# EAGLE design threshold_control_device_smd (EAGLE 6.2)
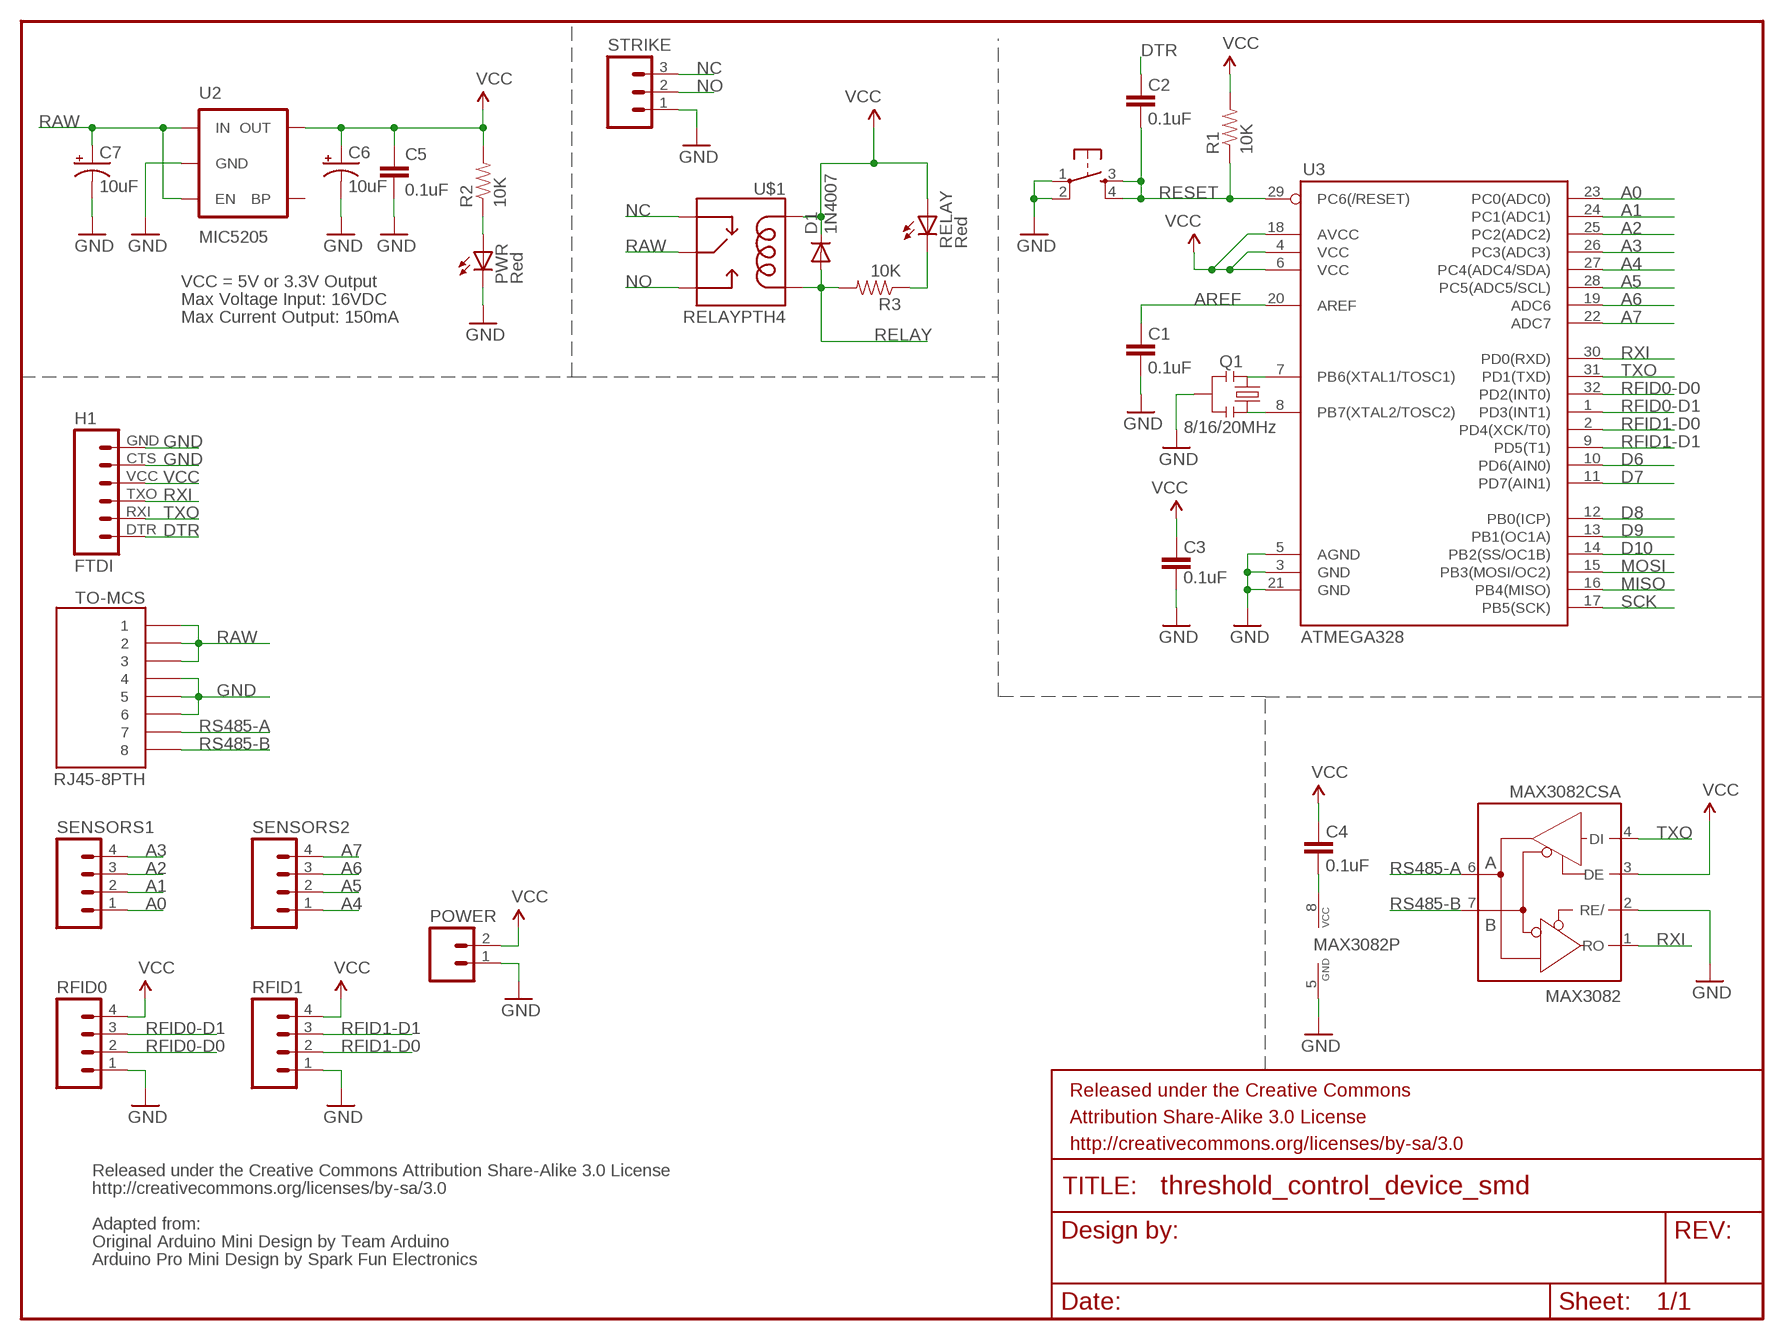
[diagram p0: schematic, sheet 1]

## Parts
C1  0.1uF  CAP0402-CAP  [0402-CAP]
C2  0.1uF  CAP0402-CAP  [0402-CAP]
C3  0.1uF  CAP0402-CAP  [0402-CAP]
C4  0.1uF  CAP0402-CAP  [0402-CAP]
C5  0.1uF  CAP0402-CAP  [0402-CAP]
C6  10uF  CAP_POL1206  [EIA3216]
C7  10uF  CAP_POL1206  [EIA3216]
D1  1N4007  DIODESMA  [SMA-DIODE]
FRAME1  FRAME-LETTER  [CREATIVE_COMMONS]
H1  FTDI  FTDI_BASICPTH  [FTDI_BASIC]
MAX3082  MAX3082CSA  MAX481CSA  [SO08]
POWER  M023.5MM  [SCREWTERMINAL-3.5MM-2]
PWR  Red  LED0603  [LED-0603]
Q1  8/16/20MHz  RESONATORSMD  [RESONATOR-SMD]
R1  10K  RESISTOR0402-RES  [0402-RES]
R2  10K  RESISTOR0402-RES  [0402-RES]
R3  10K  RESISTOR0402-RES  [0402-RES]
RELAY  Red  LED0603  [LED-0603]
RESET  Reset  TAC_SWITCHSMD  [TACTILE_SWITCH_SMD]
RFID0  M04SCREW  [SCREWTERMINAL-3.5MM-4]
RFID1  M04SCREW  [SCREWTERMINAL-3.5MM-4]
SENSORS1  M04SCREW  [SCREWTERMINAL-3.5MM-4]
SENSORS2  M04SCREW  [SCREWTERMINAL-3.5MM-4]
STRIKE  M03SCREW  [SCREWTERMINAL-3.5MM-3]
TO-MCS  RJ45-8PTH  [RJ45-8]
U2  MIC5205  V_REG_LDOSMD  [SOT23-5]
U3  ATMEGA328  ATMEGA168  [TQFP32-08]
U$1  RELAYPTH4  [RELAY-JZC]

## Nets
A0: SENSORS1.1 U3.23(PC0(ADC0))
A1: SENSORS1.2 U3.24(PC1(ADC1))
A2: SENSORS1.3 U3.25(PC2(ADC2))
A3: SENSORS1.4 U3.26(PC3(ADC3))
A4: SENSORS2.1 U3.27(PC4(ADC4/SDA))
A5: SENSORS2.2 U3.28(PC5(ADC5/SCL))
A6: SENSORS2.3 U3.19(ADC6)
A7: SENSORS2.4 U3.22(ADC7)
AREF: C1.2 U3.20(AREF)
D6: U3.10(PD6(AIN0))
D7: U3.11(PD7(AIN1))
D8: U3.12(PB0(ICP))
D9: U3.13(PB1(OC1A))
D10: U3.14(PB2(SS/OC1B))
DTR: C2.2 H1.DTR
GND [vcc]: C1.1 C3.1 C5.2 C6.C(-) C7.C(-) H1.CTS H1.GND MAX3082.2(RE/) MAX3082.5(GND) POWER.1 PWR.C Q1.2 RESET.1 RESET.2 RFID0.1 RFID1.1 STRIKE.1 TO-MCS.4 TO-MCS.5 TO-MCS.6 U2.2(GND) U3.3(GND) U3.5(AGND) U3.21(GND)
MISO: U3.16(PB4(MISO))
MOSI: U3.15(PB3(MOSI/OC2))
N$1: Q1.1 U3.8(PB7(XTAL2/TOSC2))
N$2: Q1.3 U3.7(PB6(XTAL1/TOSC1))
N$3: C4.1 MAX3082.8(VCC)
N$4: R3.1 RELAY.C
N$38: PWR.A R2.1
NC: STRIKE.3 U$1.2(NC)
NO: STRIKE.2 U$1.3(NO)
RAW [vcc]: C7.A(+) TO-MCS.1 TO-MCS.2 TO-MCS.3 U2.1(IN) U2.3(EN) U$1.4(MAIN)
RELAY: D1.A R3.2 U$1.1(COIL2)
RESET: C2.1 R1.1 RESET.3 RESET.4 U3.29(PC6(/RESET))
RFID0-D0: RFID0.2 U3.32(PD2(INT0))
RFID0-D1: RFID0.3 U3.1(PD3(INT1))
RFID1-D0: RFID1.2 U3.2(PD4(XCK/T0))
RFID1-D1: RFID1.3 U3.9(PD5(T1))
RS485-A: MAX3082.6(A) TO-MCS.7
RS485-B: MAX3082.7(B) TO-MCS.8
RXI: H1.TXO MAX3082.1(RO) U3.30(PD0(RXD))
SCK: U3.17(PB5(SCK))
TXO: H1.RXI MAX3082.4(DI) U3.31(PD1(TXD))
VCC: C3.2 C4.2 C5.1 C6.A(+) D1.C H1.VCC MAX3082.3(DE) POWER.2 R1.2 R2.2 RELAY.A RFID0.4 RFID1.4 U2.5(OUT) U3.4(VCC) U3.6(VCC) U3.18(AVCC) U$1.5(COIL1)
Unconnected: U2.4(BP)

## Notes on the sheet
- VCC = 5V or 3.3V Output
- Max Voltage Input: 16VDC
- Max Current Output: 150mA
- Released under the Creative Commons Attribution Share-Alike 3.0 License
- http://creativecommons.org/licenses/by-sa/3.0
- Adapted from:
- Original Arduino Mini Design by Team Arduino
- Arduino Pro Mini Design by Spark Fun Electronics

## Library data of the parts
C1-C5 = SparkFun:CAP: Capacitor Standard 0603 ceramic capacitor, and 0.1" leaded capacitor.
C6 C7 = SparkFun:CAP_POL: Capacitor Polarized These are standard SMD and PTH capacitors. Normally 10uF, 47uF, and 100uF in electrolytic and tantalum varieties. Always verify the external diameter of the through hole cap, it varies with capacity, voltage, and manufacturer. The EIA devices should be standard.
D1 = SparkFun-DiscreteSemi:DIODE: Diode These are standard reverse protection diodes and small signal diodes. SMA package can handle up to about 1A. SOD-323 can handle about 200mA. What the SOD-323 package when ordering, there are some mfgs out there that are 5-pin packages.
FRAME1 = SparkFun-Aesthetics:FRAME-LETTER: Schematic Frame Standard 8.5x11 US Letter frame
H1 = SparkFun-Connectors:FTDI_BASIC: FTDI Basic header with labels
MAX3082 = maxim:MAX481CSA: RS485 TRANSEIVER; MF: MAXIM; MPN: MAX481CSA; OC_FARNELL: unknown; OC_NEWARK: 90C3817
POWER = SparkFun-Connectors:M02: Header 2 Standard 2-pin 0.1" header. Use with straight break away headers (SKU : PRT-00116), right angle break away headers (PRT-00553), swiss pins (PRT-00743), machine pins (PRT-00117), and female headers (PRT-00115). Molex polarized connector foot print use with SKU : PRT-08233 with associated crimp pins and housings.
PWR RELAY = SparkFun:LED: LEDs Standard schematic elements and footprints for 5mm, 3mm, 1206, and 0603 sized LEDs. 5mm - Spark Fun Electronics SKU : COM-00529 (and others)
Q1 = SparkFun:RESONATOR: Resonator Small SMD resonator. This is the itty bitty 10/20MHz resonators with built in caps. CSTCE10M0G55 and CSTCE20M0V53. Footprint has been reviewed closely but hasn't been tested yet.
R1-R3 = SparkFun:RESISTOR: Resistor Basic schematic elements and footprints for 0603, 1206, and PTH resistors.
RESET = SparkFun:TAC_SWITCH: Momentary Switch Button commonly used for reset or general input. Spark Fun Electronics SKU : COM-00097
RFID0 RFID1 SENSORS1 SENSORS2 = SparkFun-Connectors:M04: Header 4 Standard 4-pin 0.1" header. Use with straight break away headers (SKU : PRT-00116), right angle break away headers (PRT-00553), swiss pins (PRT-00743), machine pins (PRT-00117), and female headers (PRT-00115). Molex polarized connector foot print use with SKU : PRT-08231 with associated crimp pins and housings. 1MM SMD Version SKU: PRT-10208
STRIKE = SparkFun-Connectors:M03: Header 3 Standard 3-pin 0.1" header. Use with straight break away headers (SKU : PRT-00116), right angle break away headers (PRT-00553), swiss pins (PRT-00743), machine pins (PRT-00117), and female headers (PRT-00115). Molex polarized connector foot print use with SKU : PRT-08232 with associated crimp pins and housings.
TO-MCS = SparkFun:RJ45-8: RJ45 Jack Simple RJ45, 8-pin connection - connector for common Cat5, Cat5e, and Cat6 Ethernet cables. Footprint not yet proven in production. Connector sku is PRT-00643; Breakout PCB sku is BOB-00716.
U2 = SparkFun:V_REG_LDO: Voltage Regulator LDO Standard 150mA LDO voltage regulator in SOT-23 layout. Micrel part MIC5205. BP (by-pass) pin is used to lower output noise with 470pF cap.
U3 = SparkFun:ATMEGA168
U$1 = SparkFun-Electromechanical:RELAY: SPDT relay (COM-00101)

## Net classes
0 default: width 0.203 mm
1 vcc: width 0.254 mm

## Board
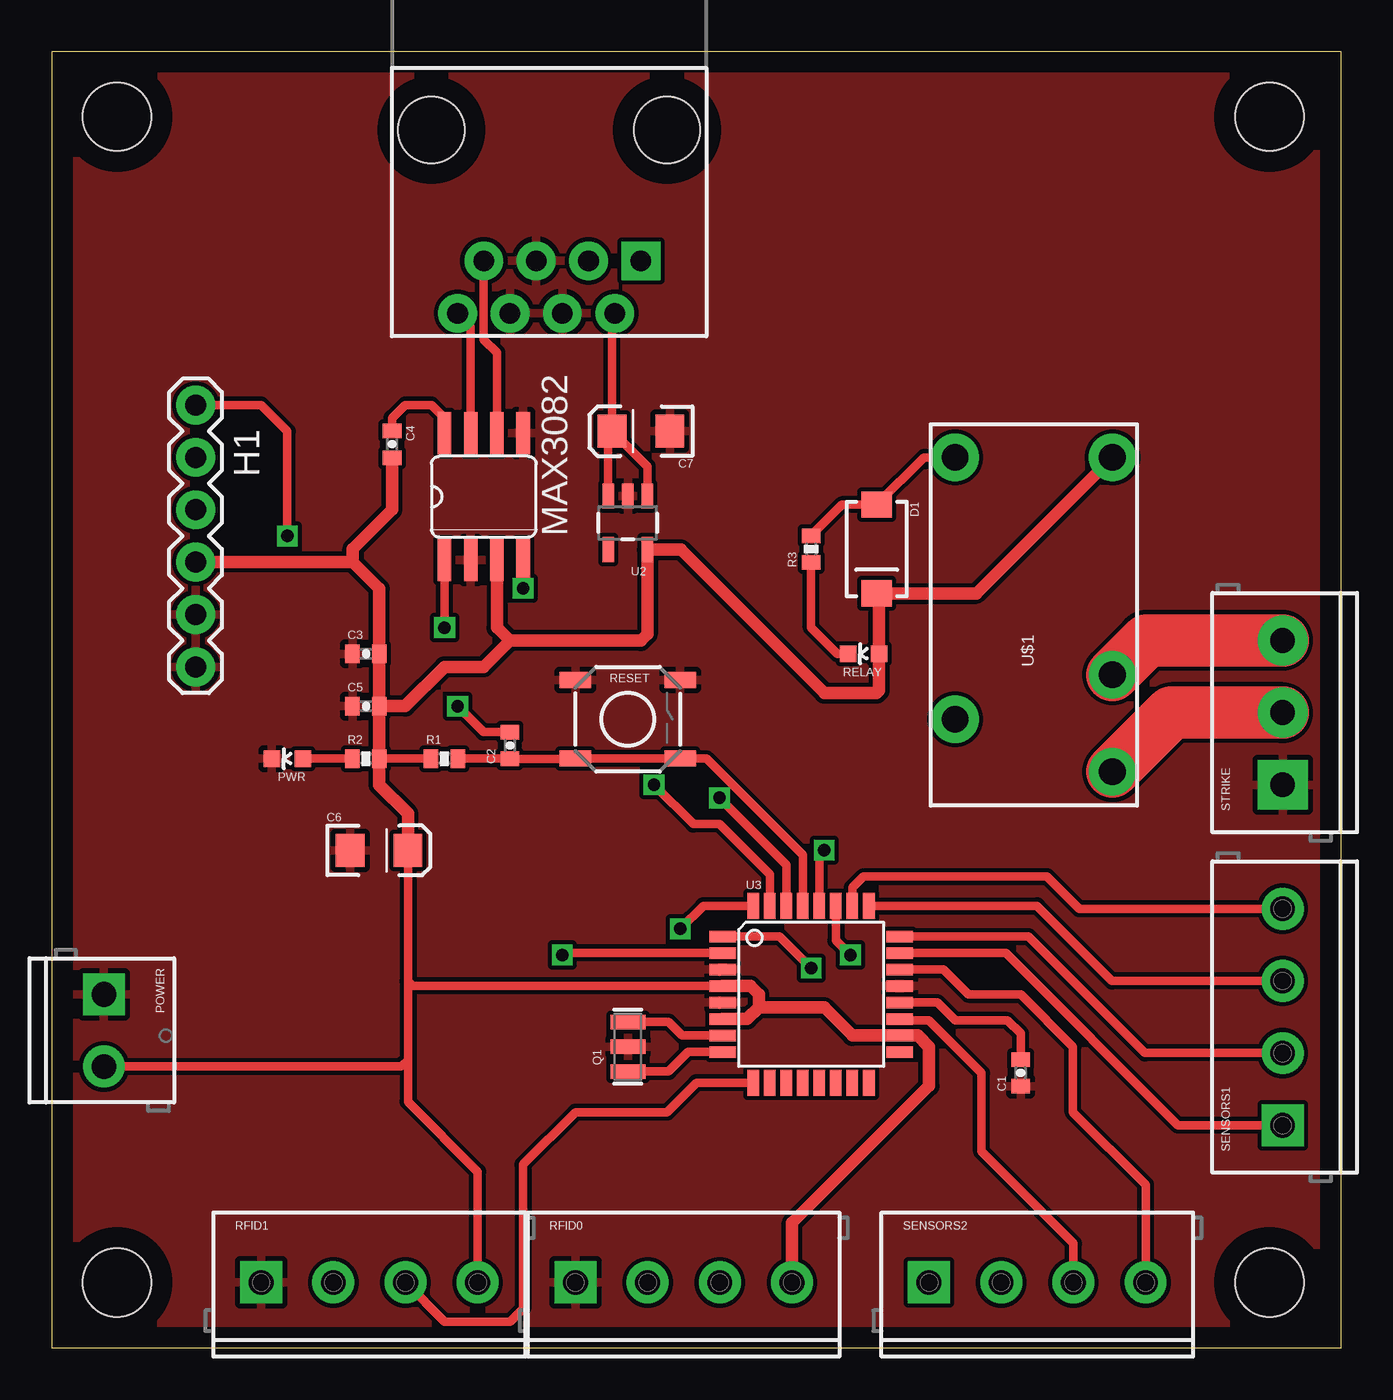
[diagram p1: board, top side]
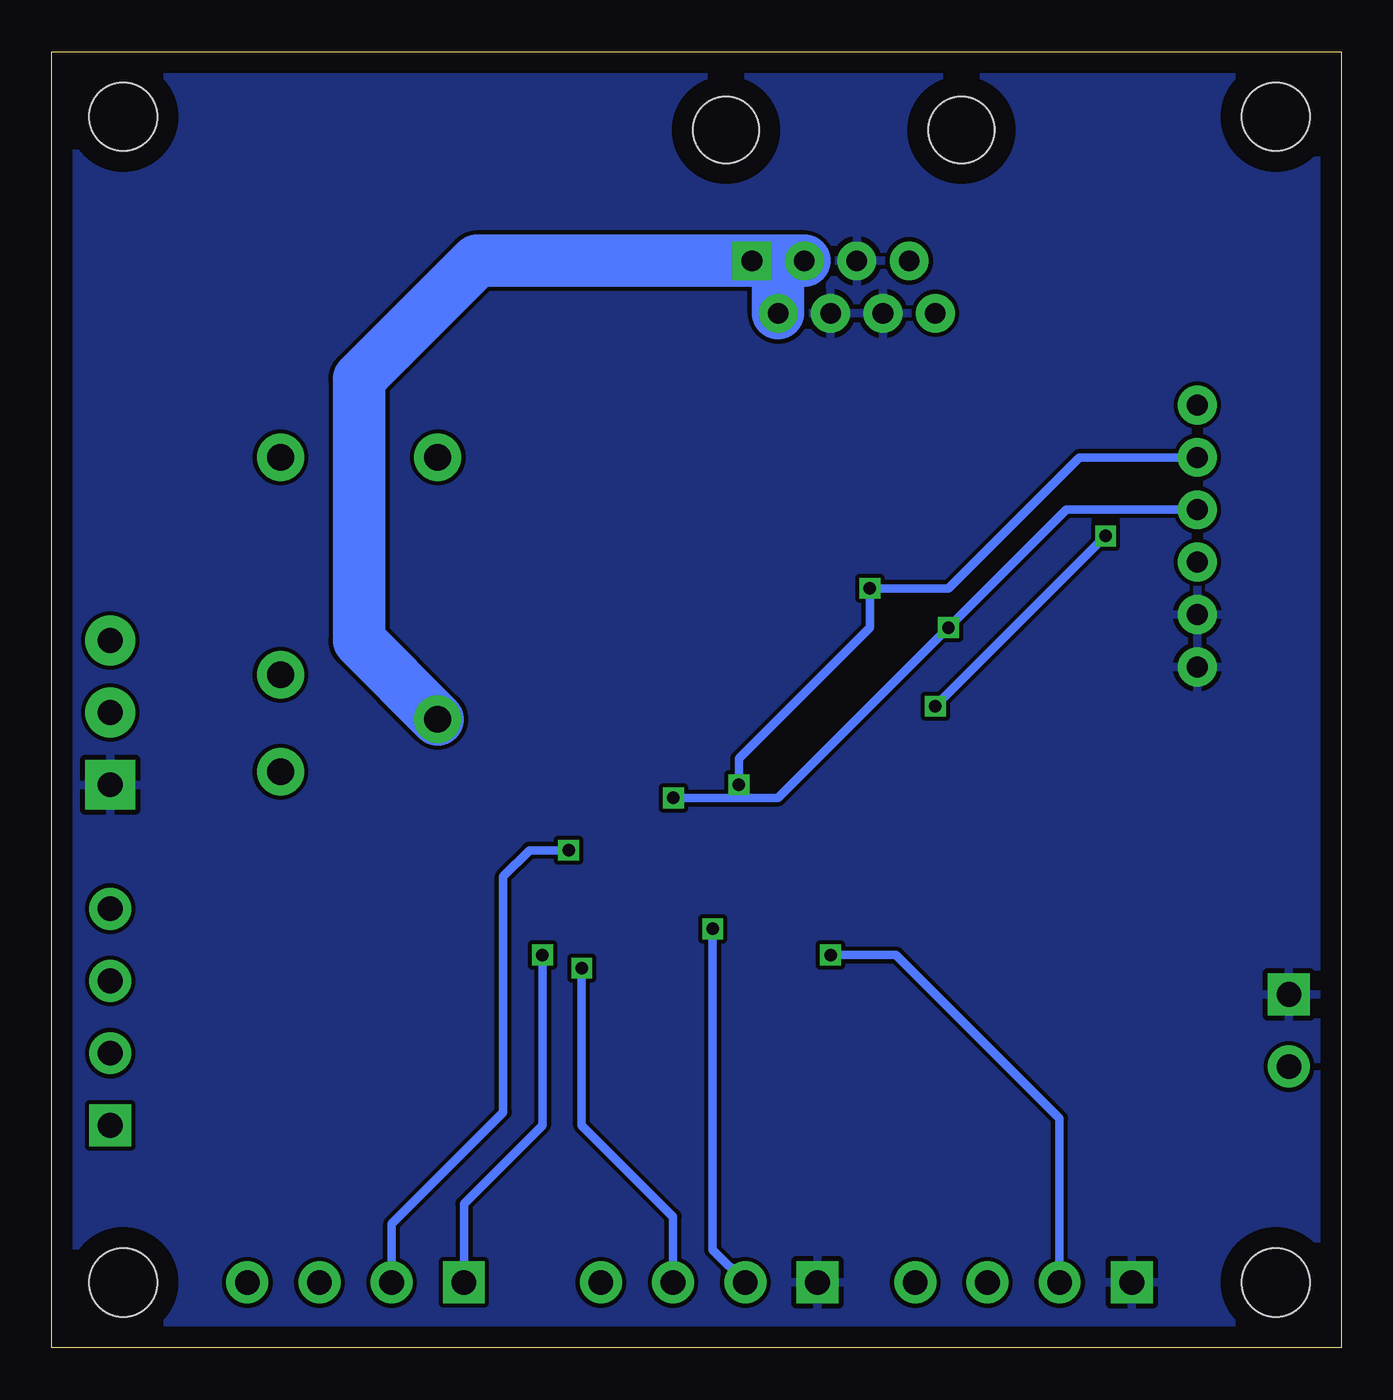
[diagram p2: board, bottom side, seen from below]

Size 62.53 x 62.85 mm. Coordinates in mm from the lower left corner, seen from the top.
Outline: 0,0 62.53,0 62.53,62.85 0,62.85 0,0
Copper layers (1*16): Top 0.035mm / dielectric 1.5mm / Bottom 0.035mm
Design rules: minimum track width 10mil, minimum drill 24mil, track to track 8mil, track to pad 8mil, pad to pad 8mil, via to via 8mil, smd to smd 8mil, copper to edge 40mil, drill to drill 8mil, minimum pad ring 10mil, minimum via ring 8mil, stop-mask expansion 4mil, vias tented up to drill 0mil, thermal gap 10mil

### Footprints (pad centres in the part's own frame; a part is rotated, then mirrored left to right if it is on the bottom)
0402-CAP = smd 0.7 x 0.9: 1 -0.65,0; 2 0.65,0
EIA3216 = smd 1.4 x 1.6: A 1.4,0; C -1.4,0
SMA-DIODE = smd 1.27 x 1.47: A -2.15,0; C 2.15,0
FTDI_BASIC = drill 1.016 pad 1.88: CTS 10.16,0; DTR 0,0; GND 12.7,0; RXI 2.54,0; TXO 5.08,0; VCC 7.62,0
SO08 = smd 0.66 x 2.032: 1 -1.905,-3.073; 2 -0.635,-3.073; 3 0.635,-3.073; 4 1.905,-3.073; 5 1.905,3.073; 6 0.635,3.073; 7 -0.635,3.073; 8 -1.905,3.073
SCREWTERMINAL-3.5MM-2 = drill 1.2 pad 2.032 square: 1 0,0 | drill 1.2 pad 2.032: 2 3.5,0
LED-0603 = smd 0.8 x 0.8: A 0,-0.75; C 0,0.75
RESONATOR-SMD = smd 0.7 x 1.7: 1 -1.2,0; 2 0,0; 3 1.2,0
0402-RES = smd 0.7 x 0.9: 1 -0.65,0; 2 0.65,0
TACTILE_SWITCH_SMD = smd 1.524 x 0.762: 1 -2.54,1.905; 2 2.54,1.905; 3 -2.54,-1.905; 4 2.54,-1.905
SCREWTERMINAL-3.5MM-4 = drill 1.2 pad 2.032 square: 1 0,0 | drill 1.2 pad 2.032: 2 3.5,0; 3 7,0; 4 10.5,0
SCREWTERMINAL-3.5MM-3 = drill 1.2 pad 2.413 square: 1 0,0 | drill 1.2 pad 2.413: 2 3.5,0; 3 7,0
RJ45-8 = drill 1 pad 1.88 square: 1 -4.445,6.35 | drill 1 pad 1.88: 2 -3.175,8.89; 3 -1.905,6.35; 4 -0.635,8.89; 5 0.635,6.35; 6 1.905,8.89; 7 3.175,6.35; 8 4.445,8.89 | hole 3.2: -5.715,0; 5.715,0
SOT23-5 = smd 0.55 x 1.2: 1 -0.95,-1.3; 2 0,-1.3; 3 0.95,-1.3; 4 0.95,1.3; 5 -0.95,1.3
TQFP32-08 = smd 1.27 x 0.559: 1 -4.293,2.8; 2 -4.293,2; 3 -4.293,1.2; 4 -4.293,0.4; 5 -4.293,-0.4; 6 -4.293,-1.2; 7 -4.293,-2; 8 -4.293,-2.8; 17 4.293,-2.8; 18 4.293,-2; 19 4.293,-1.2; 20 4.293,-0.4; 21 4.293,0.4; 22 4.293,1.2; 23 4.293,2; 24 4.293,2.8 | smd 0.559 x 1.27: 9 -2.8,-4.293; 10 -2,-4.293; 11 -1.2,-4.293; 12 -0.4,-4.293; 13 0.4,-4.293; 14 1.2,-4.293; 15 2,-4.293; 16 2.8,-4.293; 25 2.8,4.293; 26 2,4.293; 27 1.2,4.293; 28 0.4,4.293; 29 -0.4,4.293; 30 -1.2,4.293; 31 -2,4.293; 32 -2.8,4.293
RELAY-JZC = drill 1.3 pad 2.286: 1 3.81,-8.89; 2 -3.81,1.651; 3 -3.81,6.35; 4 3.81,3.81; 5 -3.81,-8.89
STAND-OFF = hole 3.302: 0,0

### Placement (x,y rotation side)
C1  46.99,13.34 90 top
C2  22.23,29.21 90 top
C3  15.24,33.66 0 top
C4  16.51,43.81 270 top
C5  15.24,31.11 180 top
C6  15.88,24.13 0 top
C7  28.57,44.45 180 top
D1  40.01,38.73 270 top
FRAME1  -77.47,36.83 0 top  (outside the outline)
H1  6.99,45.72 270 top
MAX3082  20.95,41.27 0 top
POWER  2.54,17.14 270 top
PWR  11.43,28.57 90 top
Q1  27.94,14.61 90 top
R1  19.05,28.57 180 top
R2  15.24,28.57 0 top
R3  36.83,38.73 90 top
RELAY  39.37,33.66 90 top
RESET  27.94,30.48 0 top
RFID0  25.4,3.17 0 top
RFID1  10.16,3.17 0 top
SENSORS1  59.69,10.79 90 top
SENSORS2  42.55,3.17 0 top
STRIKE  59.69,27.3 90 top
TO-MCS  24.13,59.05 180 top
U2  27.94,40.01 180 top
U3  36.83,17.14 0 top
U$1  47.62,34.29 180 top
U$2  [STAND-OFF]  3.17,59.69 0 top
U$3  [STAND-OFF]  59.05,59.69 0 top
U$4  [STAND-OFF]  3.17,3.17 0 top
U$5  [STAND-OFF]  59.05,3.17 0 top

### Tracks (layer width: path | path; a pad name or v marks a point on that pad's centre or on a via)
A0
  Top 0.406: SENSORS1.1 54.61,10.79 46.26,19.14 U3.23
A1
  Top 0.406: U3.24 47.37,19.95 53.02,14.29 SENSORS1.2
A2
  Top 0.406: SENSORS1.3 51.42,17.8 47.78,21.44 U3.25
A3
  Top 0.406: SENSORS1.4 49.83,21.3 48.26,22.86 39.37,22.86 38.83,22.32 U3.26
A4  (via drill 0.6)
  Top 0.406: U3.27 38.03,19.75 v38.73,19.05
  Bottom 0.406: v38.73,19.05 38.73,10.79 42.55,6.99 SENSORS2.1
A5  (via drill 0.6)
  Top 0.406: U3.28 37.23,23.89 v37.47,24.13
  Bottom 0.406: SENSORS2.2 46.05,6.03 40.64,11.43 40.64,22.86 39.37,24.13 v37.47,24.13
A6
  Top 0.406: SENSORS2.3 49.55,5.07 45.09,9.53 45.09,13.34 42.55,15.88 41.19,15.88 U3.19
A7
  Top 0.406: SENSORS2.4 53.05,7.92 49.53,11.43 49.53,14.61 46.99,17.14 44.45,17.14 43.25,18.34 U3.22
AREF
  Top 0.406: C1.2 46.99,15.24 46.35,15.88 43.81,15.88 42.95,16.75 U3.20
DTR  (via drill 0.6)
  Top 0.406: C2.2 20.94,29.86 v19.68,31.11 | v11.43,39.37 11.43,44.45 10.16,45.72 H1.DTR
  Bottom 0.406: v19.68,31.11 v11.43,39.37
GND
  pour Top: 0,0 62.87,0 62.87,62.87 0,62.87
  pour Bottom: 0,0 62.87,0 62.87,62.87 0,62.87
N$1
  Top 0.406: Q1.1 29.91,13.4 30.86,14.35 U3.8
N$2
  Top 0.406: Q1.3 29.91,15.8 30.57,15.14 U3.7
N$3
  Top 0.406: MAX3082.8 19.05,45.09 18.41,45.72 17.14,45.72 16.51,45.09 C4.1
N$4
  Top 0.406: RELAY.C 38.1,33.66 36.83,34.92 R3.1
N$38
  Top 0.406: PWR.A R2.1
NC
  Top 2.54: STRIKE.3 53.1,34.3 U$1.2
NO
  Top 2.54: STRIKE.2 54.3,30.8 U$1.3
RAW
  Top 0.406: U2.3 26.99,44.27 C7.A | C7.A 27.18,50.03 TO-MCS.2 | U2.1 28.89,42.73 C7.A
  Bottom 2.54: U$1.4 47.62,34.29 47.62,46.99 41.91,52.7 TO-MCS.1 27.3,52.7 | TO-MCS.3 27.3,52.7 | TO-MCS.2 27.3,52.7
RELAY
  Top 0.406: U$1.1 42.3,43.18 D1.A 38.33,40.88 R3.2
RESET
  Top 0.406: R1.1 22.21,28.57 C2.1 25.39,28.56 RESET.3 RESET.4 31.75,28.57 36.43,23.89 U3.29
RFID0-D0  (via drill 0.6)
  Top 0.406: U3.32 31.6,21.44 v30.48,20.32
  Bottom 0.406: v30.48,20.32 30.48,4.75 RFID0.2
RFID0-D1  (via drill 0.6)
  Top 0.406: v36.83,18.41 35.3,19.95 U3.1
  Bottom 0.406: RFID0.3 32.4,6.37 36.83,10.79 v36.83,18.41
RFID1-D0  (via drill 0.6)
  Top 0.406: U3.2 24.86,19.14 v24.77,19.05
  Bottom 0.406: RFID1.2 13.66,11.12 21.59,19.05 v24.77,19.05
RFID1-D1
  Top 0.406: U3.9 31.27,12.85 29.84,11.43 25.4,11.43 22.86,8.89 22.86,1.91 22.23,1.27 19.07,1.27 RFID1.3
RS485-A
  Top 0.406: MAX3082.6 21.59,48.26 20.95,48.9 TO-MCS.7
RS485-B
  Top 0.406: MAX3082.7 20.32,49.53 TO-MCS.8
RXI  (via drill 0.6)
  Top 0.406: U3.30 35.63,23.43 v32.38,26.67 | v19.05,34.92 MAX3082.1
  Bottom 0.406: v32.38,26.67 27.3,26.67 v19.05,34.92 13.34,40.64 H1.TXO
TXO  (via drill 0.6)
  Top 0.406: U3.31 34.83,22.95 32.38,25.4 31.11,25.4 v29.21,27.3 | v22.86,36.83 MAX3082.4
  Bottom 0.406: v29.21,27.3 29.21,28.57 22.86,34.92 v22.86,36.83 19.05,36.83 12.7,43.18 H1.RXI
VCC
  Top 0.406: 40.12,36.47 D1.C | R1.2 R2.2 15.88,28.56 | C6.A 17.27,17.78 | 17.27,17.78 17.27,13.97 | 17.27,13.97 17.27,11.94 20.66,8.55 RFID1.4 | U3.4 17.51,17.55 17.27,17.78 | POWER.2 16.95,13.64 17.27,13.97
  Top 0.61: 40.12,36.47 RELAY.A 40.12,31.86 40.01,31.75 37.47,31.75 30.51,38.7 U2.5 28.89,34.6 28.57,34.29 22.23,34.29 | D1.C 44.84,36.59 U$1.5 | C5.1 C3.2 15.89,36.81 14.61,38.1 | U3.6 33.73,15.95 34.29,16.51 | 34.29,16.51 34.29,17.14 33.89,17.55 U3.4 | 34.29,16.51 37.47,16.51 38.83,15.14 U3.18 42.01,15.14 42.55,14.61 42.55,12.7 35.9,6.05 RFID0.4 | 22.23,34.29 20.95,33.02 19.05,33.02 17.14,31.11 C5.1 | MAX3082.3 21.59,34.92 22.23,34.29 | R2.2 C5.1 | C6.A 17.27,25.91 15.88,27.3 15.88,28.56 | 14.61,38.1 H1.VCC | 14.61,38.1 14.61,38.73 16.51,40.64 C4.2